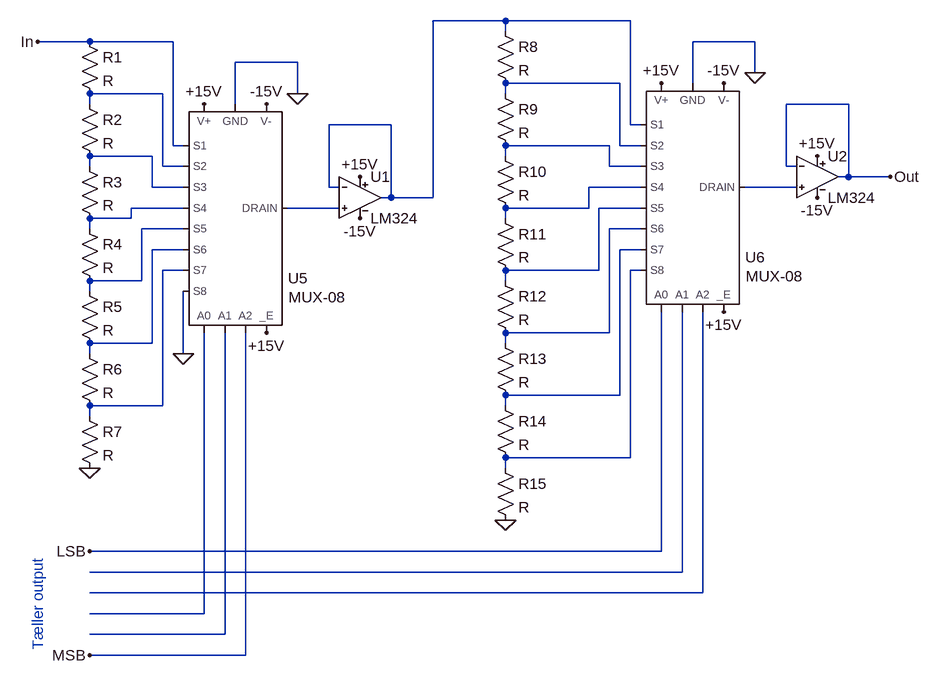
[diagram p0: schematic daemper.asc]
daemper.asc, the LTspice schematic file:
Version 4
SHEET 1 1356 956
WIRE 624 -80 512 -80
WIRE 816 -80 624 -80
WIRE 624 -64 624 -80
WIRE -16 -48 -96 -48
WIRE 112 -48 -16 -48
WIRE 1008 -48 912 -48
WIRE 304 -16 208 -16
WIRE 1008 0 1008 -48
WIRE 800 16 624 16
WIRE 912 16 912 -48
WIRE 96 32 -16 32
WIRE 304 32 304 -16
WIRE 624 32 624 16
WIRE -16 48 -16 32
WIRE 208 48 208 -16
WIRE 1152 48 1056 48
WIRE 448 80 352 80
WIRE 816 80 816 -80
WIRE 832 80 816 80
WIRE 112 112 112 -48
WIRE 128 112 112 112
WIRE 784 112 624 112
WIRE 800 112 800 16
WIRE 832 112 800 112
WIRE 80 128 -16 128
WIRE 624 128 624 112
WIRE -16 144 -16 128
WIRE 96 144 96 32
WIRE 128 144 96 144
WIRE 784 144 784 112
WIRE 832 144 784 144
WIRE 1056 144 1056 48
WIRE 1072 144 1056 144
WIRE 1152 160 1152 48
WIRE 1152 160 1136 160
WIRE 1216 160 1152 160
WIRE 80 176 80 128
WIRE 128 176 80 176
WIRE 352 176 352 80
WIRE 368 176 352 176
WIRE 832 176 752 176
WIRE 1072 176 992 176
WIRE 448 192 448 80
WIRE 448 192 432 192
WIRE 512 192 512 -80
WIRE 512 192 448 192
WIRE 128 208 48 208
WIRE 368 208 288 208
WIRE 752 208 752 176
WIRE 752 208 624 208
WIRE 832 208 768 208
WIRE 48 224 48 208
WIRE 48 224 -16 224
WIRE 624 224 624 208
WIRE -16 240 -16 224
WIRE 128 240 64 240
WIRE 832 240 784 240
WIRE 128 272 80 272
WIRE 832 272 800 272
WIRE 128 304 96 304
WIRE 768 304 768 208
WIRE 768 304 624 304
WIRE 832 304 816 304
WIRE 64 320 64 240
WIRE 64 320 -16 320
WIRE 624 320 624 304
WIRE -16 336 -16 320
WIRE 784 400 784 240
WIRE 784 400 624 400
WIRE 80 416 80 272
WIRE 80 416 -16 416
WIRE 624 416 624 400
WIRE -16 432 -16 416
WIRE 128 432 128 336
WIRE 800 496 800 272
WIRE 800 496 624 496
WIRE 96 512 96 304
WIRE 96 512 -16 512
WIRE 624 512 624 496
WIRE -16 528 -16 512
WIRE 816 592 816 304
WIRE 816 592 624 592
WIRE 624 608 624 592
WIRE 864 736 864 368
WIRE 864 736 -16 736
WIRE 896 768 896 368
WIRE 896 768 -16 768
WIRE 928 800 928 368
WIRE 928 800 -16 800
WIRE 160 832 160 400
WIRE 160 832 -16 832
WIRE 192 864 192 400
WIRE 192 864 -16 864
WIRE 224 896 224 400
WIRE 224 896 -16 896
FLAG -16 608 0
FLAG 624 688 0
FLAG 1216 160 Out
FLAG -96 -48 In
FLAG 400 160 +15V
FLAG 1104 128 +15V
FLAG 400 224 -15V
FLAG 1104 192 -15V
FLAG 128 432 0
FLAG 1008 0 0
FLAG -16 736 LSB
FLAG -16 896 MSB
FLAG 160 48 +15V
FLAG 864 16 +15V
FLAG 304 32 0
FLAG 256 48 -15V
FLAG 960 16 -15V
FLAG 256 400 +15V
FLAG 960 368 +15V
SYMBOL res -32 -64 R0
SYMATTR InstName R1
SYMBOL res -32 32 R0
SYMATTR InstName R2
SYMBOL res -32 128 R0
SYMATTR InstName R3
SYMBOL res -32 224 R0
SYMATTR InstName R4
SYMBOL res -32 320 R0
SYMATTR InstName R5
SYMBOL res -32 416 R0
SYMATTR InstName R6
SYMBOL res -32 512 R0
SYMATTR InstName R7
SYMBOL res 608 -80 R0
SYMATTR InstName R8
SYMBOL res 608 16 R0
SYMATTR InstName R9
SYMBOL res 608 112 R0
SYMATTR InstName R10
SYMBOL res 608 208 R0
SYMATTR InstName R11
SYMBOL res 608 304 R0
SYMATTR InstName R12
SYMBOL res 608 400 R0
SYMATTR InstName R13
SYMBOL res 608 496 R0
SYMATTR InstName R14
SYMBOL myLib\\LM324 400 128 R0
SYMATTR InstName U1
SYMBOL res 608 592 R0
SYMATTR InstName R15
SYMBOL myLib\\LM324 1104 96 R0
SYMATTR InstName U2
SYMBOL myLib\\MUX-08 96 400 R0
SYMATTR InstName U5
SYMBOL myLib\\MUX-08 800 368 R0
SYMATTR InstName U6
TEXT -96 888 VLeft 0 ;Tæller output

The netlist it stands for:
* daemper.asc
R1 In N003 R
R2 N003 N005 R
R3 N005 N008 R
R4 N008 N011 R
R5 N011 N013 R
R6 N013 N015 R
R7 N015 0 R
R8 N001 N002 R
R9 N002 N004 R
R10 N004 N006 R
R11 N006 N010 R
R12 N010 N012 R
R13 N012 N014 R
R14 N014 N016 R
XU1 N009 N001 +15V -15V N001 LM324  ; pins In+ In- V+ V- OUT
R15 N016 0 R
XU2 N007 Out +15V -15V Out LM324  ; pins In+ In- V+ V- OUT
XU5 N019 N020 N009 0 +15V In N003 N005 N008 N011 N013 N015 0 MSB -15V +15V MUX-08 MUX-08  ; pins A0 A1 DRAIN GND V+ S1 S2 S3 S4 S5 S6 S7 S8 A2 V- _E
XU6 LSB N017 N007 0 +15V N001 N002 N004 N006 N010 N012 N014 N016 N018 -15V +15V MUX-08 MUX-08  ; pins A0 A1 DRAIN GND V+ S1 S2 S3 S4 S5 S6 S7 S8 A2 V- _E
* Tæller output
.lib myLib\LM324.lib
.backanno
.end